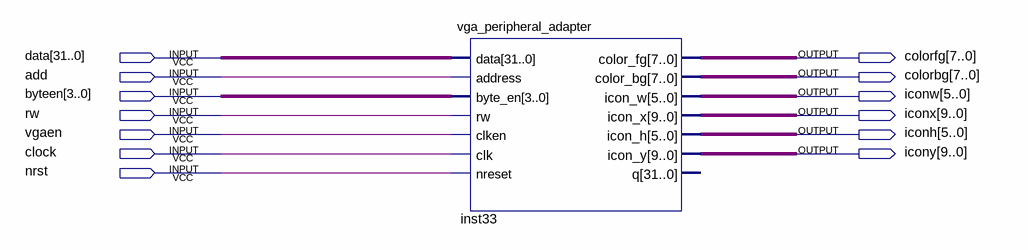
[diagram p0: schematic sheet]
// Quartus schematic vga_peripheral_adapter_test.bdf as structural Verilog: 1 symbols, 13 pins
module vga_peripheral_adapter_test (
  input  [31:0] data,
  input  add,
  input  [3:0] byteen,
  input  rw,
  input  vgaen,
  input  clock,
  input  nrst,
  output [7:0] colorfg,
  output [7:0] colorbg,
  output [5:0] iconw,
  output [9:0] iconx,
  output [5:0] iconh,
  output [9:0] icony
);

  vga_peripheral_adapter inst33 (
    .data(data), .address(add), .byte_en(byteen), .rw(rw), .clken(vgaen), .clk(clock), .nreset(nrst),
    .color_fg(colorfg), .color_bg(colorbg), .icon_w(iconw), .icon_x(iconx), .icon_h(iconh), .icon_y(icony));  // open: q
endmodule
